# EAGLE design GB-WP-D1 (EAGLE 9.6.1)
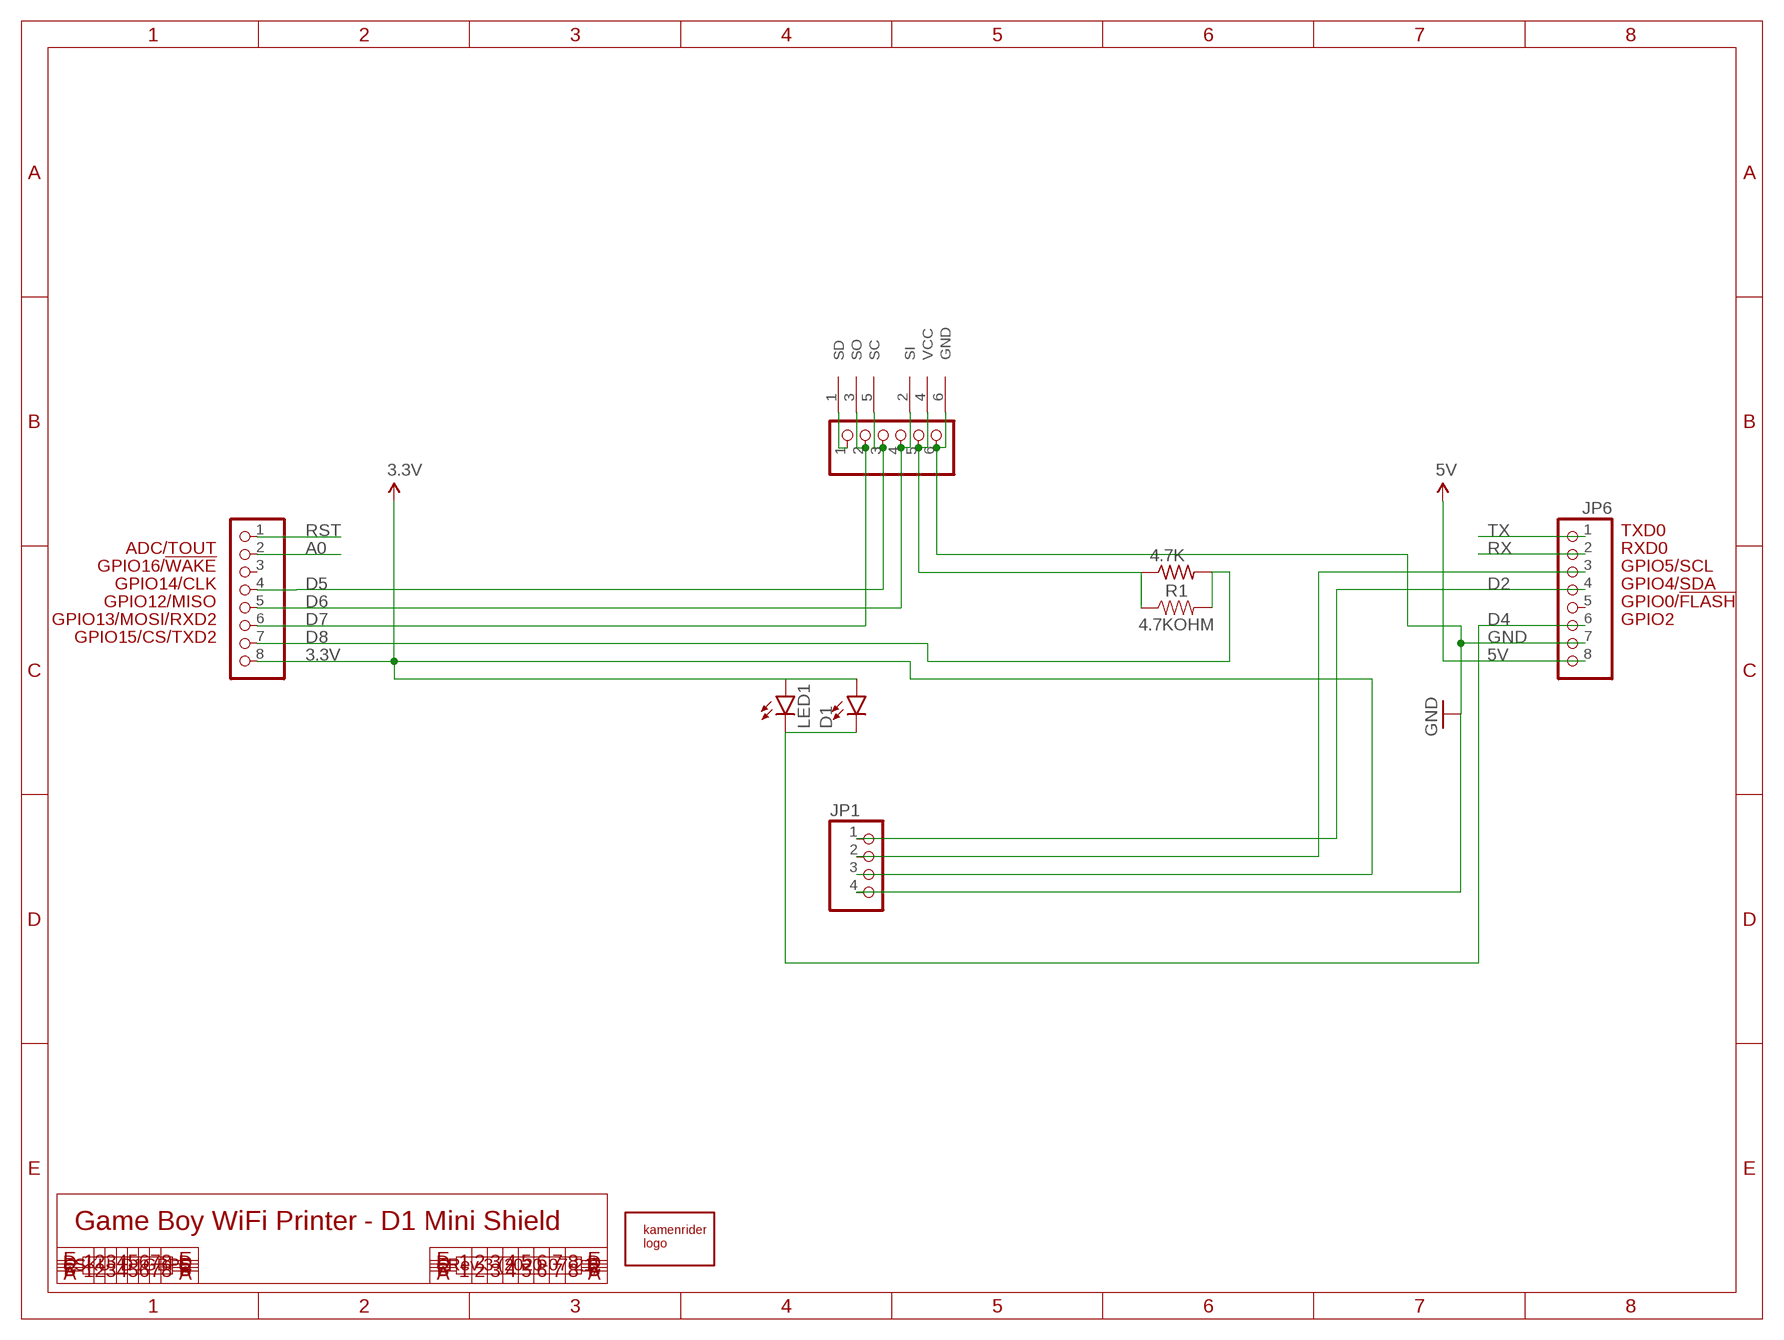
[diagram p0: schematic, sheet 1]

## Parts
4.7K  R-US_0207/10  [0207/10]
D1  LED1206  [LED-1206]
JP1  PINHD-1X4/OCT  [1X04/OCT]
JP3  PINHD-1X8/OCT  [1X08/OCT]
JP4  PINHD-1X6/OCT  [1X06/OCT]
JP6  PINHD-1X8/OCT  [1X08/OCT]
LED1  LED3MM  [LED3MM]
R1  4.7KOHM  [1206]
U$2  GB-LINK-PADS  [GB-LINK-PCB]
U$3  KAMENRIDER_LOGOV2_COLOR_OPAC  [10_6_V2]

## Nets
3.3V: D1.A JP1.3 JP3.8 LED1.A
5V: JP6.8
A0: JP3.2
D2: JP1.1 JP6.4
D4: D1.C JP6.6 LED1.K(C)
D5: JP3.4 JP4.3 U$2.5(SC)
D6: JP3.5 JP4.4 U$2.2(SI)
D7: JP3.6 JP4.2 U$2.3(SO)
D8: 4.7K.2 JP3.7 R1.2
GND: JP1.4 JP4.6 JP6.7 U$2.6(GND)
N$1: JP4.1 U$2.1(SD)
N$5: 4.7K.1 JP4.5 R1.1 U$2.4(VCC)
N$7: JP1.2 JP6.3
RST: JP3.1
RX: JP6.2
TX: JP6.1
Unconnected: JP3.3 JP6.5

## Notes on the sheet
- TXD0
- ADC/TOUT | RXD0
- GPIO16/!WAKE | GPIO5/SCL
- GPIO14/CLK | GPIO4/SDA
- GPIO12/MISO | GPIO0/!FLASH
- GPIO13/MOSI/RXD2 | GPIO2
- GPIO15/CS/TXD2
- Game Boy WiFi Printer - D1 Mini Shield
- SKU: D1GBPS | Rev.3 (2020-07-21)

## Library data of the parts
4.7K = resistor:R-US_: RESISTOR, American symbol
D1 = SparkFun-LED:LED: LED (Generic) Standard schematic elements and footprints for 5mm, 3mm, 1206, and 0603 sized LEDs. Generic LEDs with no color specified.
JP1 = pinhead_v2:PINHD-1X4: PIN HEADER
JP3 JP6 = pinhead_v2:PINHD-1X8: PIN HEADER
JP4 = pinhead_v2:PINHD-1X6: PIN HEADER
LED1 = led:LED: LED OSRAM: - CHIPLED LG R971, LG N971, LY N971, LG Q971, LY Q971, LO R971, LY R971 LH N974, LH R974 LS Q976, LO Q976, LY Q976 LO Q996 - Hyper CHIPLED LW Q18S LB Q993, LB Q99A, LB R99A - SideLED LS A670, LO A670, LY A670, LG A670, LP A670 LB A673, LV A673, LT A673, LW A673 LH A674 LY A675 LS A676, LA A676, LO A676, LY A676, LW A676 LS A679, LY A679, LG A679 - Hyper Micro SIDELED® LS Y876, LA Y876, LO Y876, LY Y876 LT Y87S - SmartLED LW L88C, LW L88S LB L89C, LB L89S, LG L890 LS L89K, LO L89K, LY L89K LS L896, LA L896, LO L896, LY L896 - TOPLED LS T670, LO T670, LY T670, LG T670, LP T670 LSG T670, LSP T670, LSY T670, LOP T670, LYG T670 LG T671, LOG T671, LSG T671 LB T673, LV T673, LT T673, LW T673 LH T674 LS T676, LA T676, LO T676, LY T676, LB T676, LH T676, LSB T676, LW T676 LB T67C, LV T67C, LT T67C, LS T67K, LO T67K, LY T67K, LW E67C LS E67B, LA E67B, LO E67B, LY E67B, LB E67C, LV E67C, LT E67C LW T67C LS T679, LY T679, LG T679 LS T770, LO T770, LY T770, LG T770, LP T770 LB T773, LV T773, LT T773, LW T773 LH T774 LS E675, LA E675, LY E675, LS T675 LS T776, LA T776, LO T776, LY T776, LB T776 LHGB T686 LT T68C, LB T68C - Hyper Mini TOPLED® LB M676 - Mini TOPLED Santana® LG M470 LS M47K, LO M47K, LY M47K Source: http://www.osram.convergy.de LUXEON: - LUMILED® LXK2-PW12-R00, LXK2-PW12-S00, LXK2-PW14-U00, LXK2-PW14-V00 LXK2-PM12-R00, LXK2-PM12-S00, LXK2-PM14-U00 LXK2-PE12-Q00, LXK2-PE12-R00, LXK2-PE12-S00, LXK2-PE14-T00, LXK2-PE14-U00 LXK2-PB12-K00, LXK2-PB12-L00, LXK2-PB12-M00, LXK2-PB14-N00, LXK2-PB14-P00, LXK2-PB14-Q00 LXK2-PR12-L00, LXK2-PR12-M00, LXK2-PR14-Q00, LXK2-PR14-R00 LXK2-PD12-Q00, LXK2-PD12-R00, LXK2-PD12-S00 LXK2-PH12-R00, LXK2-PH12-S00 LXK2-PL12-P00, LXK2-PL12-Q00, LXK2-PL12-R00 Source: www.luxeon.com KINGBRIGHT: KA-3528ASYC Source: www.kingbright.com
R1 = SparkFun-Resistors:4.7KOHM: 4.7kΩ resistor A resistor is a passive two-terminal electrical component that implements electrical resistance as a circuit element. Resistors act to reduce current flow, and, at the same time, act to lower voltage levels within circuits. - Wikipedia
U$2 = link-port-pcb:GB-LINK-PADS
U$3 = kamenrider:KAMENRIDER_LOGO

## Net classes
0 default: width 0.203 mm, drill 0.356 mm, clearance 0.152 mm
1 power: width 0.203 mm, clearance 0.152 mm

## Board
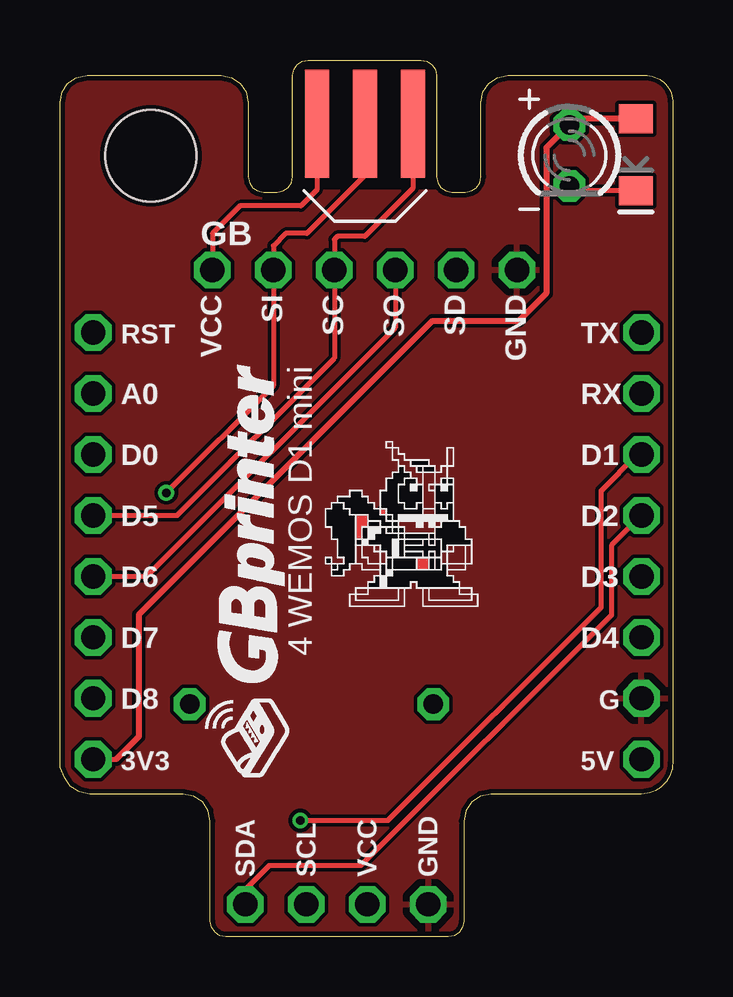
[diagram p1: board, top side]
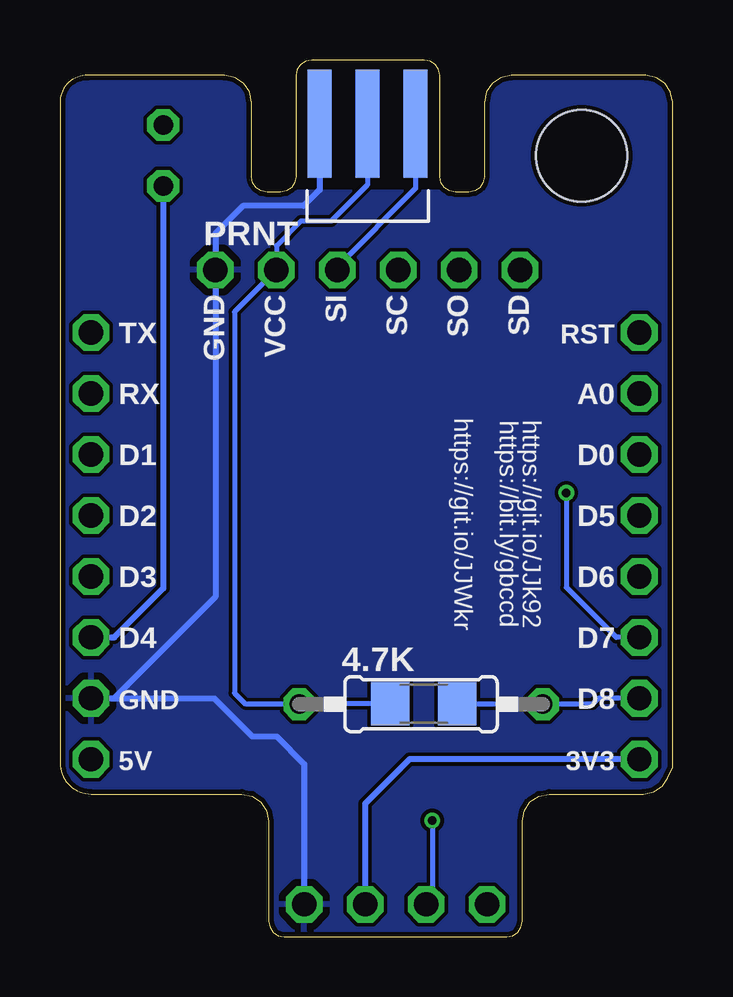
[diagram p2: board, bottom side, seen from below]

Size 25.54 x 36.53 mm. Coordinates in mm from the lower left corner, seen from the top.
Outline: 9.7,35.89 9.75,36.14 9.89,36.34 10.1,36.48 10.35,36.53 15.06,36.53 15.31,36.48 15.52,36.34 15.65,36.14 15.7,35.89 15.7,31.68 15.75,31.42 15.89,31.22 16.1,31.08 16.35,31.03 16.91,31.03 17.16,31.08 17.37,31.22 17.51,31.42 17.56,31.68 17.56,34.76 17.64,35.2 17.89,35.56 18.24,35.8 18.68,35.89 24.38,35.89 arc-90 25.54,34.83 25.54,7.25 arc-90 24.24,5.95 17.97,5.95 17.53,5.86 17.17,5.62 16.93,5.26 16.84,4.82 16.84,0.64 16.79,0.39 16.65,0.19 16.45,0.05 16.2,0 6.91,0 6.66,0.05 6.46,0.19 6.32,0.39 6.27,0.64 6.27,4.82 6.18,5.26 5.94,5.62 5.58,5.86 5.15,5.95 1.23,5.95 0.79,6.04 0.44,6.28 0.19,6.64 0,7.07 0,34.76 0.09,35.2 0.33,35.56 0.69,35.8 1.13,35.89 6.73,35.89 7.16,35.8 7.52,35.56 7.76,35.2 7.85,34.76 7.85,31.68 7.9,31.42 8.04,31.22 8.24,31.08 8.49,31.03 9.06,31.03 9.31,31.08 9.51,31.22 9.65,31.42 9.7,31.68 9.7,35.89
Copper layers (1*16): Top 0.035mm / dielectric 1.5mm / Bottom 0.035mm
Design rules "ElectroDragon_2layer_DRU_no_angle_20140221 *": minimum track width 6mil, minimum drill 12mil, track to track 6mil, track to pad 6mil, pad to pad 6mil, via to via 6mil, smd to smd 6mil, copper to edge 8mil, drill to drill 6mil, minimum pad ring 10mil, minimum via ring 6mil, stop-mask expansion 4mil, vias tented up to drill 100mil, thermal gap 0.3mm
Holes 3.81 mm at 3.79,32.55

### Footprints (pad centres in the part's own frame; a part is rotated, then mirrored left to right if it is on the bottom)
0207/10 = drill 0.813 octagon: 1 -5.08,0; 2 5.08,0
LED-1206 = smd 1.2 x 1.4: A -1.5,0; C 1.5,0
1X04/OCT = drill 1.016 octagon: 1 -3.81,0; 2 -1.27,0; 3 1.27,0; 4 3.81,0
1X08/OCT = drill 1.016 octagon: 1 -8.89,0; 2 -6.35,0; 3 -3.81,0; 4 -1.27,0; 5 1.27,0; 6 3.81,0; 7 6.35,0; 8 8.89,0
1X06/OCT = drill 1.016 octagon: 1 -6.35,0; 2 -3.81,0; 3 -1.27,0; 4 1.27,0; 5 3.81,0; 6 6.35,0
LED3MM = drill 0.813 octagon: A -1.27,0; K 1.27,0
1206 = smd 1.6 x 1.8: 1 -1.4,0; 2 1.4,0
GB-LINK-PCB = smd 1 x 4.5: 1 -2,0; 3 0,0; 5 2,0 | smd 1 x 4.5 bottom: 2 -2,0; 4 0,0; 6 2,0

### Placement (x,y rotation side)
4.7K  10.49,9.69 0 bottom
D1  24.01,32.59 270 top
JP1  11.55,1.35 0 top
JP3  1.39,16.29 270 top
JP4  12.71,27.78 0 top
JP6  24.25,16.29 270 top
LED1  21.24,32.56 270 top
R1  10.38,9.71 0 bottom
U$2  12.71,33.88 0 top
U$3  10.75,13.25 0 top

### Tracks (layer width: path | path; a pad name or v marks a point on that pad's centre or on a via)
3.3V
  Top 0.203: JP3.8 2.35,7.4 | 21.49,34.08 LED1.A | D1.A 24,34.08
  Top 0.254: 2.35,7.4 3.29,8.34 3.29,13.42 15.54,25.67 19.14,25.67 20.28,26.81 20.28,32.87 LED1.A | 24,34.08 21.49,34.08
  Bottom 0.254: JP3.8 10.96,7.4 12.82,5.54 JP1.3
D2
  Top 0.203: JP1.1 7.74,1.99 8.71,2.96 12.53,2.96 23,13.41 23,16.31 JP6.4
D4
  Top 0.203: D1.C 21.44,31.09 LED1.K
  Bottom 0.254: LED1.K 21.24,14.52 23.28,12.48 JP6.6
D5
  Top 0.203: U$2.5 14.71,31.18 12.71,29.18 11.57,29.18 11.44,29.05 JP4.3 11.44,24.11 4.89,17.56 JP3.4
D6
  Top 0.203: JP4.4 13.98,25.38 3.62,15.02 JP3.5
  Bottom 0.203: U$2.2 10.71,31.18 13.98,27.91 JP4.4
D7  (via drill 0.36)
  Top 0.203: U$2.3 12.71,31.72 10.3,29.31 9.41,29.31 8.9,28.8 JP4.2 8.9,22.96 v4.43,18.5
  Bottom 0.203: v4.43,18.5 4.43,14.56 2.35,12.48 JP3.6
D8
  Bottom 0.203: JP3.7 3.1,9.94 3.34,9.69 4.7K.2 8.96,9.69 R1.2
GND
  Bottom 0.203: 23.28,9.94 JP6.7
  Bottom 0.254: U$2.6 14.71,31.12 15.38,30.45 17.92,30.45 19.06,29.31 JP4.6 19.06,14.16 23.28,9.94 | JP6.7 19.12,9.94 17.52,8.34 16.5,8.34 15.36,7.2 JP1.4
  pour Bottom: -0.52,-1.06 -0.52,37.55 9.39,37.55 9.39,31.07 16.63,31.07 16.63,37.42 27.04,37.17 27.04,-1.06
  pour Top: 9.39,31.07 16.5,31.07 16.5,37.42 27.17,37.42 27.17,-0.93 -0.52,-0.93 -0.52,37.04 9.39,37.04
N$1
  Top 0.203: U$2.1 10.71,31.12 10.04,30.45 7.5,30.45 6.36,29.31 JP4.1
N$5
  Bottom 0.203: U$2.4 12.71,31.34 14.23,29.82 15.5,29.82 16.52,28.8 JP4.5 18.27,26.04 18.27,10.16 17.8,9.69 15.7,9.69 | 15.7,9.69 4.7K.1 15.59,9.72 | R1.1 15.68,9.71 15.7,9.69
N$7  (via drill 0.36)
  Top 0.203: v10.02,4.85 13.69,4.85 22.56,13.72 22.56,18.59 24.07,20.1 JP6.3
  Bottom 0.203: v10.02,4.85 10.02,1.61 JP1.2

### Text on the board
tPlace: GB | VCC | SI | SC | SO | SD | GND | RST | TX | A0 | RX | D0 | D1 | D5 | D2 | D6 | D3 | D7 | D4 | D8 | G | 3V3 | 5V | SDA | SCL | VCC | GND
bPlace: PRNT | SD | SO | SC | SI | VCC | GND | RST | TX | A0 | RX | D0 | D1 | D5 | https://git.io/JJk92 / https://bit.ly/gbccd / / https://git.io/JJWkr | D2 | D6 | D3 | D7 | D4 | D8 | GND | 3V3 | 5V
tNames: 4 WEMOS D1 mini